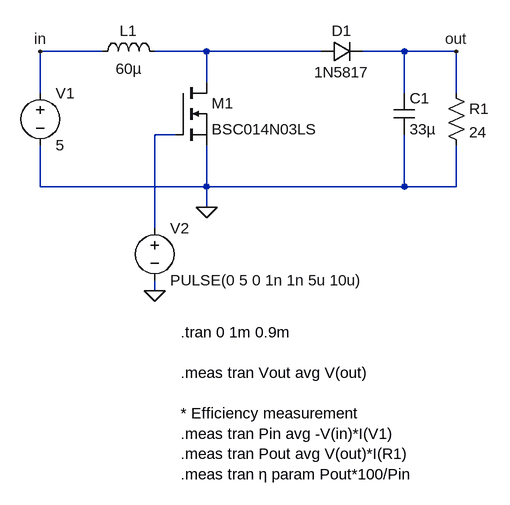
[diagram p0: schematic boost_converter.asc]
boost_converter.asc, the LTspice schematic file:
Version 4.1
SHEET 1 896 724
WIRE 112 80 16 80
WIRE 272 80 192 80
WIRE 448 80 272 80
WIRE 576 80 512 80
WIRE 656 80 576 80
WIRE 272 128 272 80
WIRE 16 144 16 80
WIRE 576 144 576 80
WIRE 656 144 656 80
WIRE 224 208 192 208
WIRE 16 288 16 224
WIRE 272 288 272 224
WIRE 272 288 16 288
WIRE 576 288 576 208
WIRE 576 288 272 288
WIRE 656 288 656 224
WIRE 656 288 576 288
WIRE 272 320 272 288
WIRE 192 352 192 208
WIRE 192 448 192 432
FLAG 272 320 0
FLAG 192 448 0
FLAG 16 80 in
FLAG 656 80 out
SYMBOL voltage 16 128 R0
WINDOW 123 0 0 Left 0
WINDOW 39 0 0 Left 0
SYMATTR InstName V1
SYMATTR Value 5
SYMBOL voltage 192 336 R0
WINDOW 123 0 0 Left 0
WINDOW 39 0 0 Left 0
SYMATTR InstName V2
SYMATTR Value PULSE(0 5 0 1n 1n 5u 10u)
SYMBOL res 640 128 R0
SYMATTR InstName R1
SYMATTR Value 24
SYMBOL ind 96 96 R270
WINDOW 0 32 56 VTop 2
WINDOW 3 5 56 VBottom 2
SYMATTR InstName L1
SYMATTR Value 60µ
SYMATTR SpiceLine Ipk=1 Rser=0.5
SYMBOL cap 560 144 R0
SYMATTR InstName C1
SYMATTR Value 33µ
SYMATTR SpiceLine V=25 Irms=2 Rser=0.1
SYMBOL diode 448 96 R270
WINDOW 0 32 32 VTop 2
WINDOW 3 0 32 VBottom 2
SYMATTR InstName D1
SYMATTR Value 1N5817
SYMBOL nmos 224 128 R0
SYMATTR InstName M1
SYMATTR Value BSC014N03LS
TEXT 232 512 Left 2 !.tran 0 1m 0.9m\n \n.meas tran Vout avg V(out)\n \n* Efficiency measurement\n.meas tran Pin avg -V(in)*I(V1)\n.meas tran Pout avg V(out)*I(R1)\n.meas tran η param Pout*100/Pin

The netlist it stands for:
* boost_converter.asc
V1 in 0 5
V2 N002 0 PULSE(0 5 0 1n 1n 5u 10u)
R1 out 0 24
L1 in N001 60µ Ipk=1 Rser=0.5
C1 out 0 33µ V=25 Irms=2 Rser=0.1
D1 N001 out 1N5817
M1 N001 N002 0 0 BSC014N03LS
.model D D
.lib standard.dio
.model NMOS NMOS
.model PMOS PMOS
.lib standard.mos
.tran 0 1m 0.9m
.meas tran Vout avg V(out)
* Efficiency measurement
.meas tran Pin avg -V(in)*I(V1)
.meas tran Pout avg V(out)*I(R1)
.meas tran η param Pout*100/Pin
.backanno
.end